# EasyEDA Pro project LeTian-robot2（轮腿机器人）.eprj, schematic Encoder-sch
Page Name: P1; Project Name: LeTian-robot2; Schematic Name: Encoder-sch; Update Date: 2022-11-08
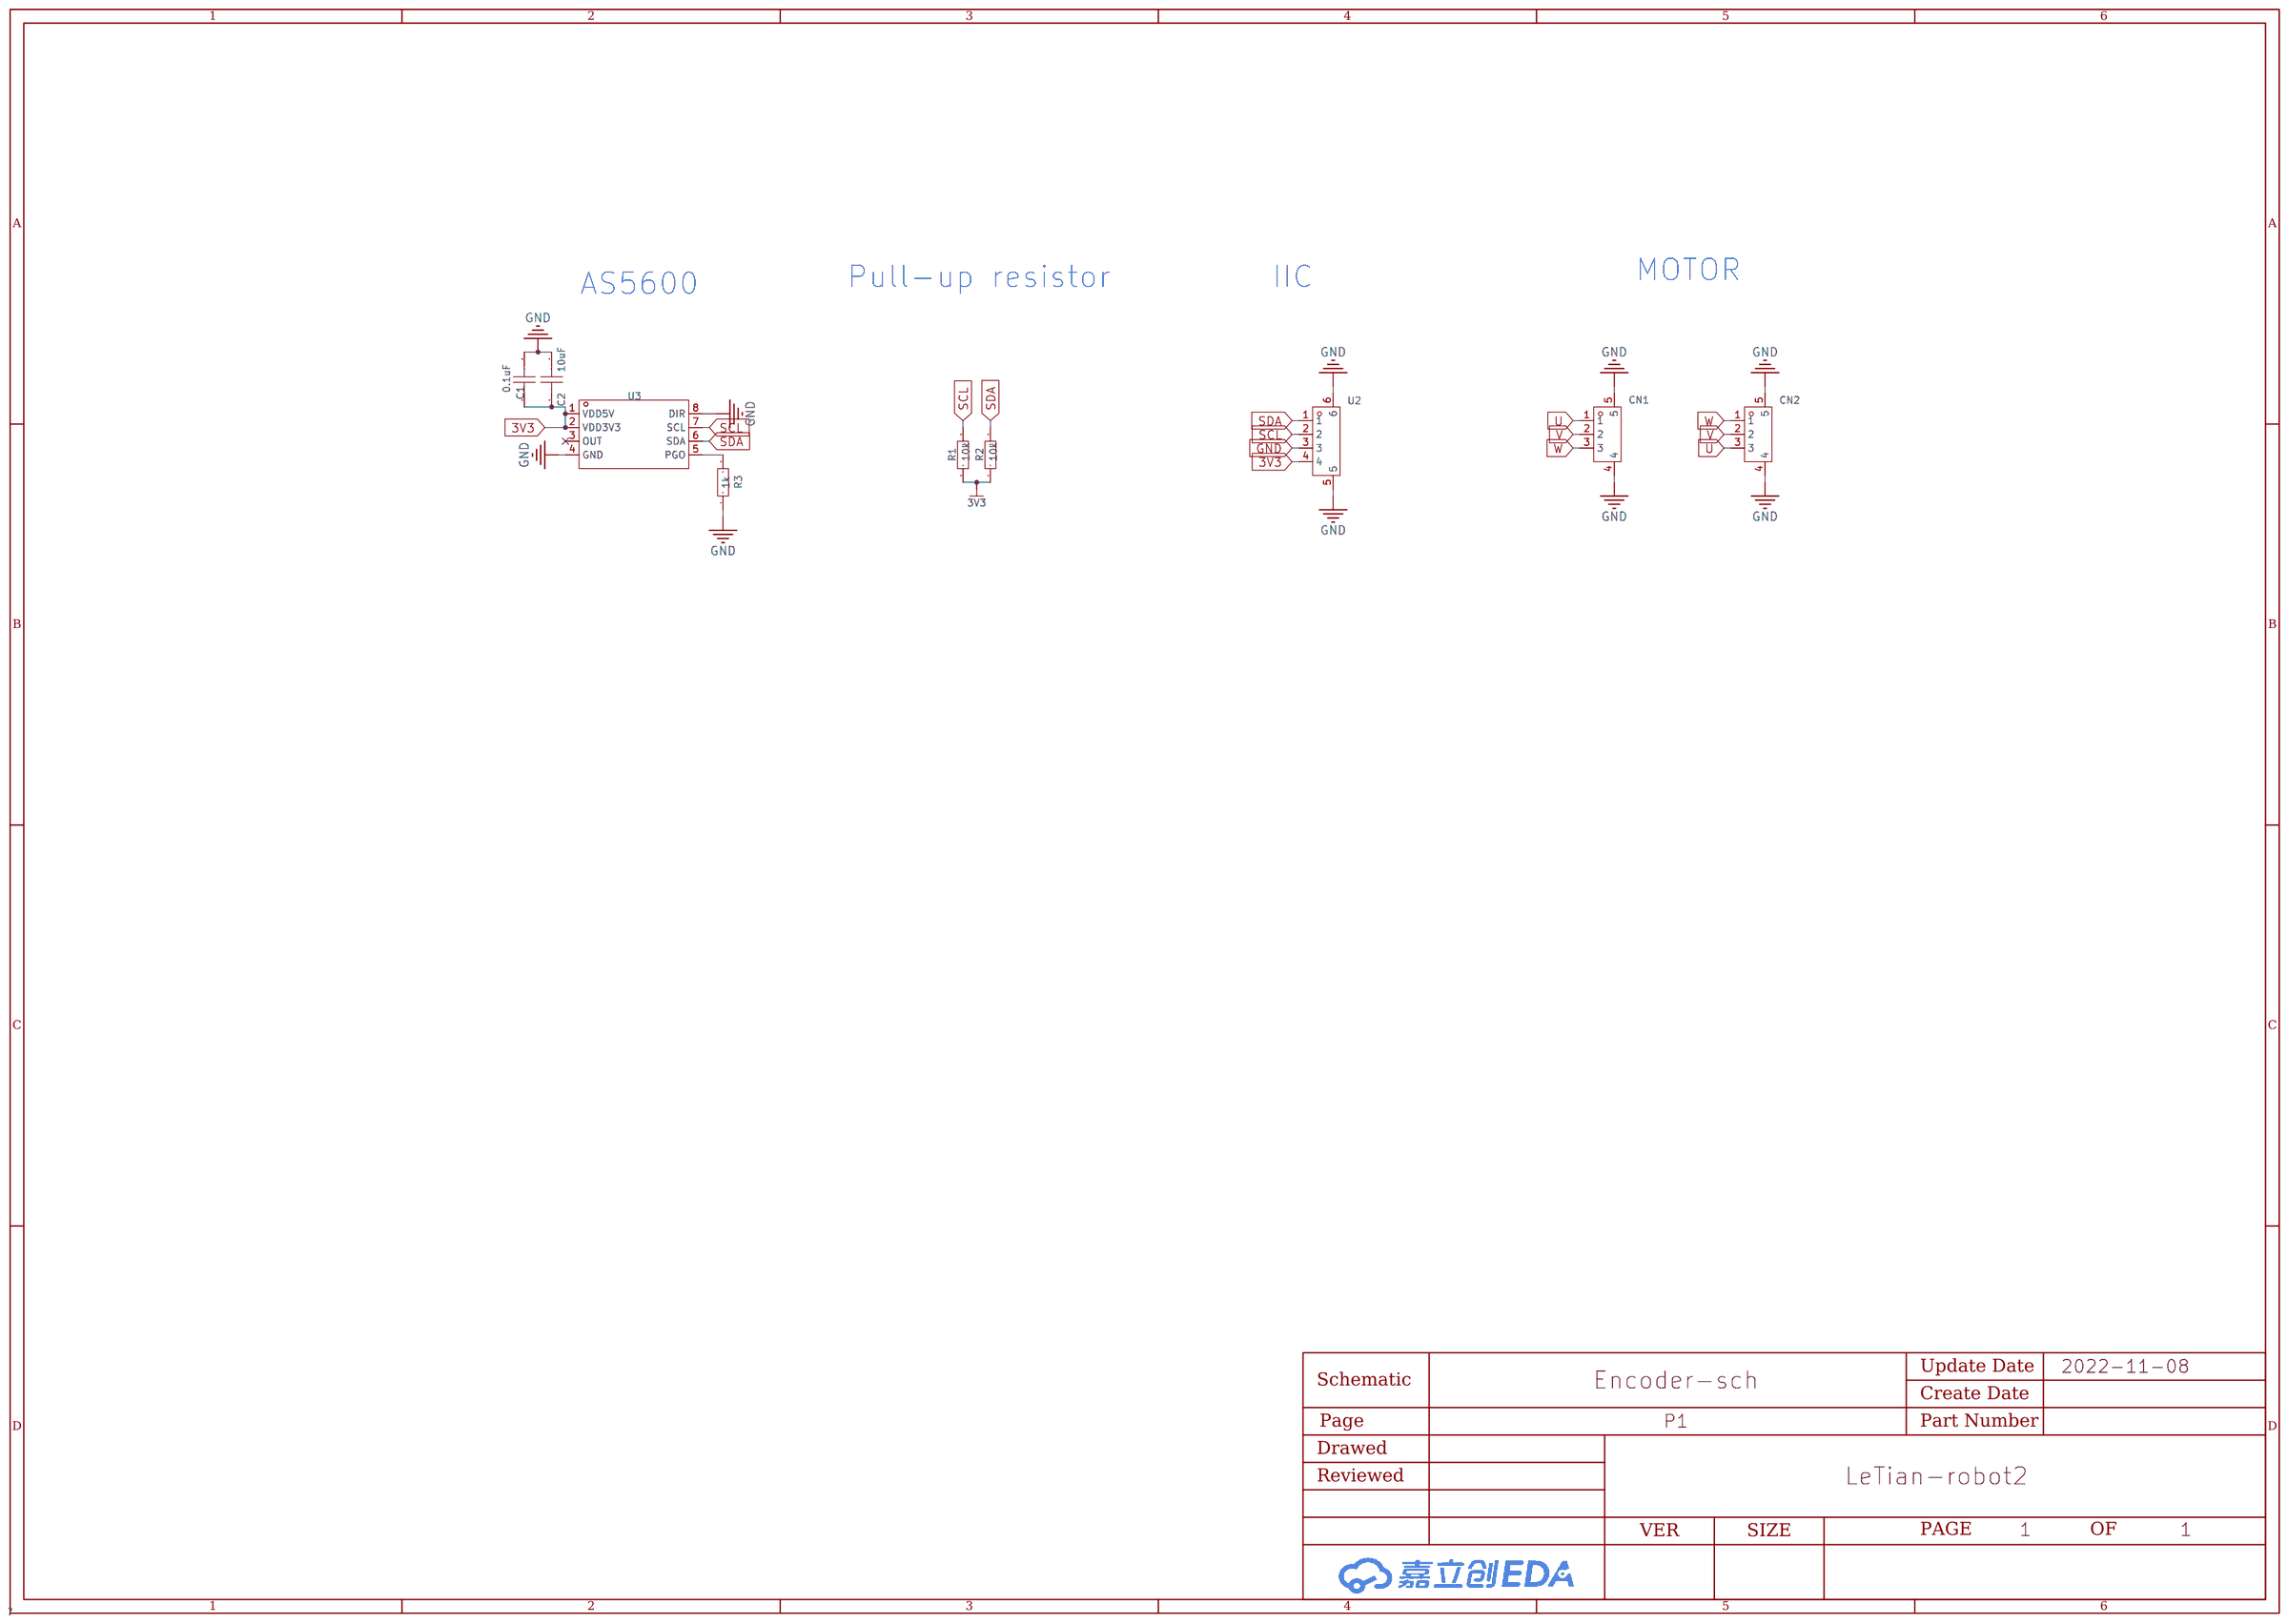
[diagram p2: schematic sheet]

## Parts
C1  0.1uF  [C0603]
C2  10uF  [C0603]
CN1  1.0K-BH-3PWB  [CONN-SMD_3P-P1.00_HDGC_1.0K-BH-3PWB]
CN2  WAFER-XH2.54-3PWB  [CONN-SMD_3P-P2.50_XUNPU_WAFER-XH2.54-3PWB]
R1  10k  [R0603]
R2  10k  [R0603]
R3  1k  [R0603]
U2  1.25-4PWTDK  [CONN-SMD_4P-P1.25_SHOUHAN_1.25-4PWTDK]
U3  AS5600-ASOM  [SOIC-8_L5.0-W4.0-P1.27-LS6.0-BL]

## Library data of the parts
C1 C2 = CL10B104KB8NNNC: 容值:100nF;精度:±10%;额定电压:50V;材质(温度系数):X7R;; LCSC Part Name: 100nF ±10% 50V; Supplier Part: C282519; Manufacturer: SAMSUNG(三星); Supplier Footprint: 0603; JLCPCB Part Class: Extended Part; Datasheet: https://atta.szlcsc.com/upload/public/pdf/source/20160103/1457707680512.pdf; Supplier: LCSC; Tolerance: ±10%; Voltage Rated: 50V; Temperature Coefficient: X7R
CN1 = 1.0K-BH-3PWB: 参考系列:-;间距:1mm;插针结构:1x3P;排数:1;每排PIN数:3;行距:-;公母:公型插针;安装方式:卧贴;额定电流:1A;工作温度范围:-25~+85;; LCSC Part Name: 1x3P 间距P=1.0mm 卧贴 SMT; Supplier Part: C2919604; Manufacturer: HDGC(华德共创); Supplier Footprint: SMD,P=1mm; JLCPCB Part Class: Extended Part; Datasheet: https://atta.szlcsc.com/upload/public/pdf/source/20211115/0C4A9B301513FDEAA34F959002791CED.pdf; Supplier: LCSC; Pitch: 1mm; Pins Structure: 1x3P; Number of Rows: 1; Number of PINs Per Row: 3; Gender: 公型插针; Mounting Style: 卧贴; Current Rating (Max): 1A; Operating Temperature Range: -25~+85
CN2 = WAFER-XH2.54-3PWB: 间距:2.5mm;插针结构:1x3P;排数:1;每排PIN数:3;公母:公型插针;安装方式:卧贴;额定电流:3A;工作温度范围:-25~+85;; LCSC Part Name: 2.5mm 1x3P 卧贴; Supplier Part: C3029477; Manufacturer: XUNPU(讯普); Supplier Footprint: SMD,P=2.5mm; JLCPCB Part Class: Extended Part; Datasheet: https://atta.szlcsc.com/upload/public/pdf/source/20220527/7ACD2214A426F03D9ACD52F5A71E518C.pdf; Supplier: LCSC; Pitch: 2.5mm; Pins Structure: 1x3P; Number of Rows: 1; Number of PINs Per Row: 3; Gender: 公型插针; Mounting Style: 卧贴; Current Rating (Max): 3A; Operating Temperature Range: -25~+85
R1-R3 = TR0603B10K0P0525Z: 电阻类型:薄膜电阻;阻值:10k;精度:±0.1%;功率:100mW;温度系数:±25ppm/;最大工作电压:75V;工作温度范围:-55~+155;; LCSC Part Name: 10k ±0.1% 100mW; Supplier Part: C25804; Manufacturer: EVER OHMS(天二科技); Supplier Footprint: 0603; JLCPCB Part Class: Extended Part; Datasheet: https://atta.szlcsc.com/upload/public/pdf/source/20190415/C188363_433BF05B6FB8F7A0F5F35A3E4390C55A.pdf; Supplier: LCSC; Type: 薄膜电阻; Tolerance: ±0.1%; Power(Watts): 100mW; Temperature Coefficient: ±25ppm/; Overload Voltage (Max): 75V; Operating Temperature Range: -55~+155
U2 = 1.25-4PWTDK: 间距:1.25mm;插针结构:1x4P;排数:1;每排PIN数:4;公母:公型插针;安装方式:卧贴;额定电流:1A;工作温度范围:-25~+85;; LCSC Part Name: 1.25mm 1x4P 卧贴 1.25间距 4P卧贴 带扣; Supplier Part: C3008554; Manufacturer: SHOU HAN(首韩); Supplier Footprint: SMD,P=1.25mm; JLCPCB Part Class: Extended Part; Datasheet: https://atta.szlcsc.com/upload/public/pdf/source/20220922/3657A7399B7A69EB7F95734BA0716837.pdf; Supplier: LCSC; Pitch: 1.25mm; Pins Structure: 1x4P; Number of Rows: 1; Number of PINs Per Row: 4; Gender: 公型插针; Mounting Style: 卧贴; Current Rating (Max): 1A; Operating Temperature Range: -25~+85
U3 = AS5600-ASOM: 非接触12bit磁角度位置传感器; Supplier Part: C79815; Manufacturer: ams(艾迈斯半导体); Supplier Footprint: SOIC-8_150mil; JLCPCB Part Class: Extended Part; Datasheet: https://atta.szlcsc.com/upload/public/pdf/source/20161027/1477535527192.pdf; Supplier: LCSC

## Nets
3V3: C1.1 C2.1 R1.1 R2.1 U2.4 U3.1(VDD5V) U3.2(VDD3V3)
GND: C1.2 C2.2 CN1.4 CN1.5 CN2.4 CN2.5 R3.1 U2.3 U2.5 U2.6 U3.4(GND) U3.8(DIR)
SCL: R1.2 U2.2 U3.7(SCL)
SDA: R2.2 U2.1 U3.6(SDA)
U: CN1.1 CN2.3
V: CN1.2 CN2.2
W: CN1.3 CN2.1
$1N599: R3.2 U3.5(PGO)

Not connected (* = marked no-connect by the designer): U3 3(OUT)*

## Notes on the sheet
- Pull-up resistor
- IIC
- MOTOR
- AS5600
